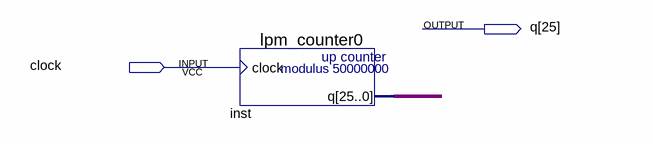
[diagram p0: schematic sheet]
// Quartus schematic Block2.bdf as structural Verilog: 1 symbols, 2 pins
module Block2 (
  input  clock,
  output [25:25] q
);

  wire [25:0] inst_q;

  lpm_counter0 inst (.clock(clock), .q(inst_q));
endmodule
